# Altium schematic sheet 03_MCU.SchDoc: OpenCamera Slider - MCU
size A4; SheetNumber: 3; SheetTotal: 4; Distributor: DigiKey
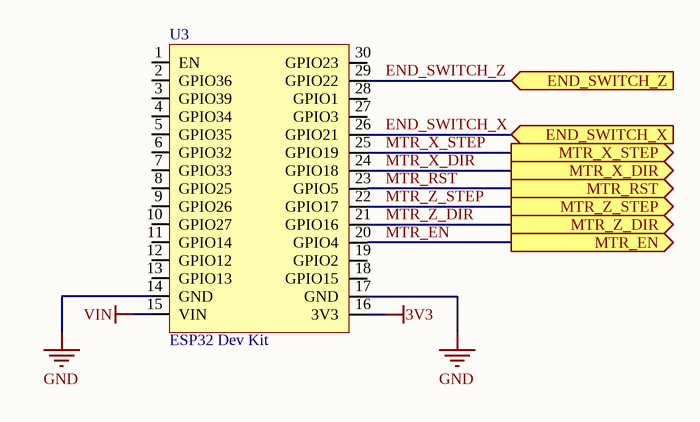
[diagram p0: 03_MCU.SchDoc]

## Parts
U3  ESP32 Dev Kit  [ESP32-DevModule]

## Ports
END_SWITCH_X (in), END_SWITCH_Z (in), MTR_EN (out), MTR_RST (out), MTR_X_DIR (out), MTR_X_STEP (out), MTR_Z_DIR (out), MTR_Z_STEP (out)

## Nets
3V3: U3.16(3V3)
GND: U3.14(GND) U3.17(GND)
VIN: U3.15(VIN)
END_SWITCH_X: U3.26(GPIO21) ; port END_SWITCH_X
END_SWITCH_Z: U3.29(GPIO22) ; port END_SWITCH_Z
MTR_EN: U3.20(GPIO4) ; port MTR_EN
MTR_RST: U3.23(GPIO5) ; port MTR_RST
MTR_X_DIR: U3.24(GPIO18) ; port MTR_X_DIR
MTR_X_STEP: U3.25(GPIO19) ; port MTR_X_STEP
MTR_Z_DIR: U3.21(GPIO16) ; port MTR_Z_DIR
MTR_Z_STEP: U3.22(GPIO17) ; port MTR_Z_STEP

Not connected (* = marked no-connect by the designer): U3 1(EN) 2(GPIO36) 3(GPIO39) 4(GPIO34) 5(GPIO35) 6(GPIO32) 7(GPIO33) 8(GPIO25) 9(GPIO26) 10(GPIO27) 11(GPIO14) 12(GPIO12) 13(GPIO13) 18(GPIO15) 19(GPIO2) 27(GPIO3) 28(GPIO1) 30(GPIO23)

## Notes on the sheet
- sasakaranovic.com/youtube
- sasakaranovic.com
- sasakaranovic.com/github
- sasakaranovic.com/facebook
- sasakaranovic.com/twitter
- sasakaranovic.com/linkedin

## Library data of the parts
U3 = ESP32_DEV: Manufacturer: Espressif; Distributor: AliExpress; Distributor Part Number: https://www.aliexpress.com/item/1005001757645011.html; URL: https://www.aliexpress.com/item/1005001757645011.html